# EAGLE design led-strip-main-connector (EAGLE 7.2.0)
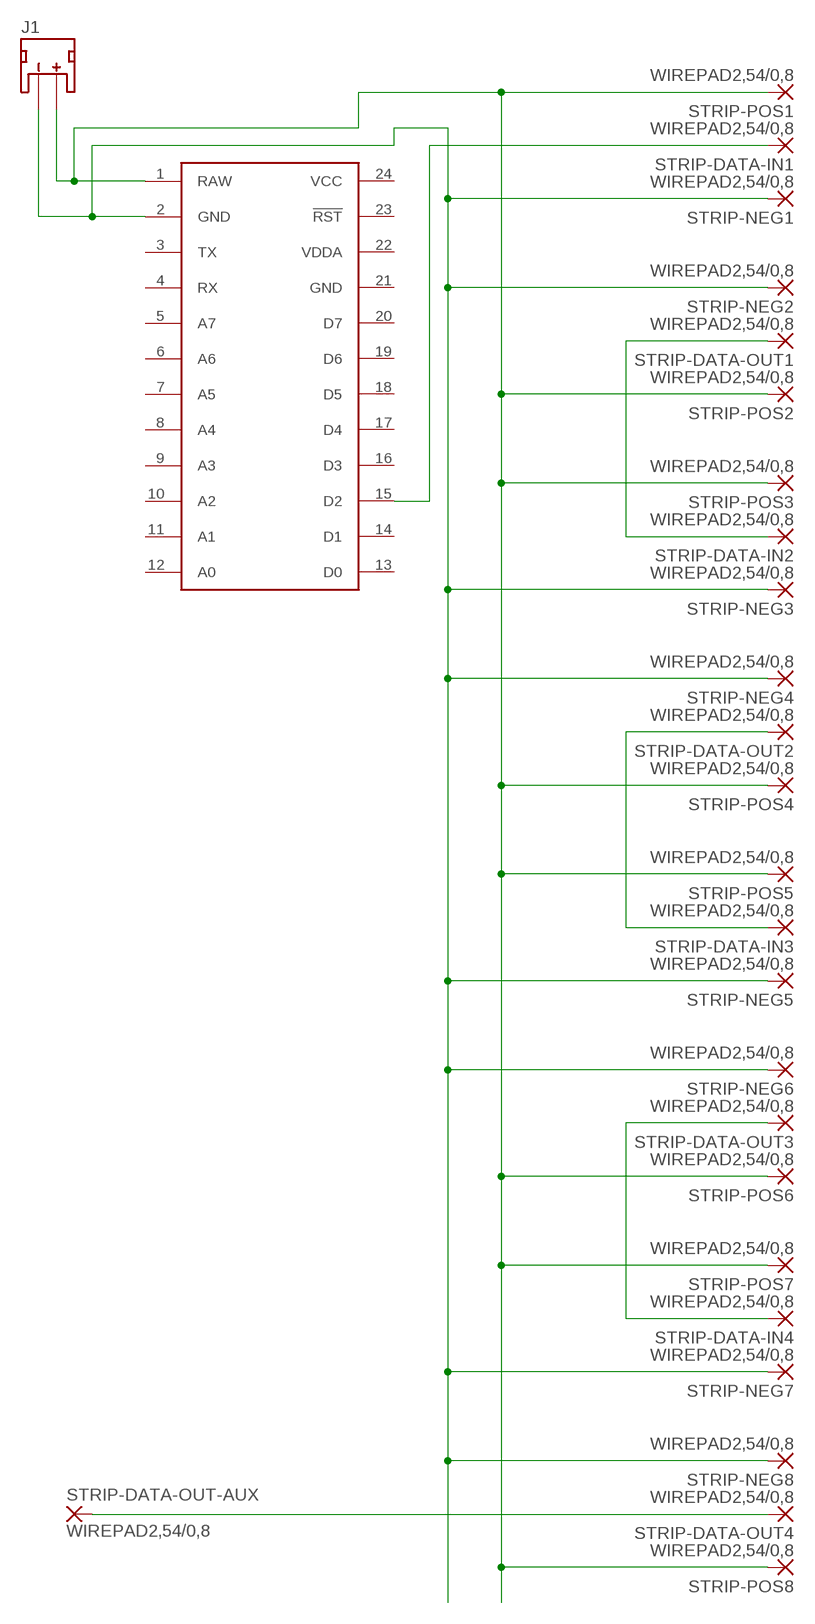
[diagram p0: schematic, sheet 1]

## Parts
J1  1  JST_2MM_MALE  [JST-2-SMD]
SPARK_CORE  SPARK_CORECORE  [SPARK_CORE]
STRIP-DATA-IN1  WIREPAD2,54/0,8  [2,54/0,8]
STRIP-DATA-IN2  WIREPAD2,54/0,8  [2,54/0,8]
STRIP-DATA-IN3  WIREPAD2,54/0,8  [2,54/0,8]
STRIP-DATA-IN4  WIREPAD2,54/0,8  [2,54/0,8]
STRIP-DATA-OUT1  WIREPAD2,54/0,8  [2,54/0,8]
STRIP-DATA-OUT2  WIREPAD2,54/0,8  [2,54/0,8]
STRIP-DATA-OUT3  WIREPAD2,54/0,8  [2,54/0,8]
STRIP-DATA-OUT4  WIREPAD2,54/0,8  [2,54/0,8]
STRIP-DATA-OUT-AUX  WIREPAD2,54/0,8  [2,54/0,8]
STRIP-NEG1  WIREPAD2,54/0,8  [2,54/0,8]
STRIP-NEG2  WIREPAD2,54/0,8  [2,54/0,8]
STRIP-NEG3  WIREPAD2,54/0,8  [2,54/0,8]
STRIP-NEG4  WIREPAD2,54/0,8  [2,54/0,8]
STRIP-NEG5  WIREPAD2,54/0,8  [2,54/0,8]
STRIP-NEG6  WIREPAD2,54/0,8  [2,54/0,8]
STRIP-NEG7  WIREPAD2,54/0,8  [2,54/0,8]
STRIP-NEG8  WIREPAD2,54/0,8  [2,54/0,8]
STRIP-POS1  WIREPAD2,54/0,8  [2,54/0,8]
STRIP-POS2  WIREPAD2,54/0,8  [2,54/0,8]
STRIP-POS3  WIREPAD2,54/0,8  [2,54/0,8]
STRIP-POS4  WIREPAD2,54/0,8  [2,54/0,8]
STRIP-POS5  WIREPAD2,54/0,8  [2,54/0,8]
STRIP-POS6  WIREPAD2,54/0,8  [2,54/0,8]
STRIP-POS7  WIREPAD2,54/0,8  [2,54/0,8]
STRIP-POS8  WIREPAD2,54/0,8  [2,54/0,8]

## Nets
N$1: SPARK_CORE.15(D2) STRIP-DATA-IN1.1(P)
N$3: STRIP-DATA-IN2.1(P) STRIP-DATA-OUT1.1(P)
N$5: J1.1(-) SPARK_CORE.2(GND) STRIP-NEG1.1(P) STRIP-NEG2.1(P) STRIP-NEG3.1(P) STRIP-NEG4.1(P) STRIP-NEG5.1(P) STRIP-NEG6.1(P) STRIP-NEG7.1(P) STRIP-NEG8.1(P)
N$6: J1.2(+) SPARK_CORE.1(RAW) STRIP-POS1.1(P) STRIP-POS2.1(P) STRIP-POS3.1(P) STRIP-POS4.1(P) STRIP-POS5.1(P) STRIP-POS6.1(P) STRIP-POS7.1(P) STRIP-POS8.1(P)
N$7: STRIP-DATA-IN3.1(P) STRIP-DATA-OUT2.1(P)
N$10: STRIP-DATA-IN4.1(P) STRIP-DATA-OUT3.1(P)
N$13: STRIP-DATA-OUT4.1(P) STRIP-DATA-OUT-AUX.1(P)
Unconnected: J1.NC1(PAD1) J1.NC2(PAD2) SPARK_CORE.3(TX) SPARK_CORE.4(RX) SPARK_CORE.5(A7) SPARK_CORE.6(A6) SPARK_CORE.7(A5) SPARK_CORE.8(A4) SPARK_CORE.9(A3) SPARK_CORE.10(A2) SPARK_CORE.11(A1) SPARK_CORE.12(A0) SPARK_CORE.13(D0) SPARK_CORE.14(D1) SPARK_CORE.16(D3) SPARK_CORE.17(D4) SPARK_CORE.18(D5) SPARK_CORE.19(D6) SPARK_CORE.20(D7) SPARK_CORE.23(!RST)

## Power pins joined to a net without a drawn wire
GND: SPARK_CORE.21(GND)
VCC: SPARK_CORE.24(VCC)
VDDA: SPARK_CORE.22(VDDA)

## Library data of the parts
J1 = SparkFun-Connectors:JST_2MM_MALE: Mates to single-cell LiPo batteries. CONN-08352; PROD_ID: CONN-08352
SPARK_CORE = Spark:SPARK_CORE
STRIP-DATA-IN1-STRIP-DATA-IN4 STRIP-DATA-OUT1-STRIP-DATA-OUT4 STRIP-DATA-OUT-AUX STRIP-NEG1-STRIP-NEG8 STRIP-POS1-STRIP-POS8 = wirepad:WIREPAD: Wire PAD connect wire on PCB

## Board
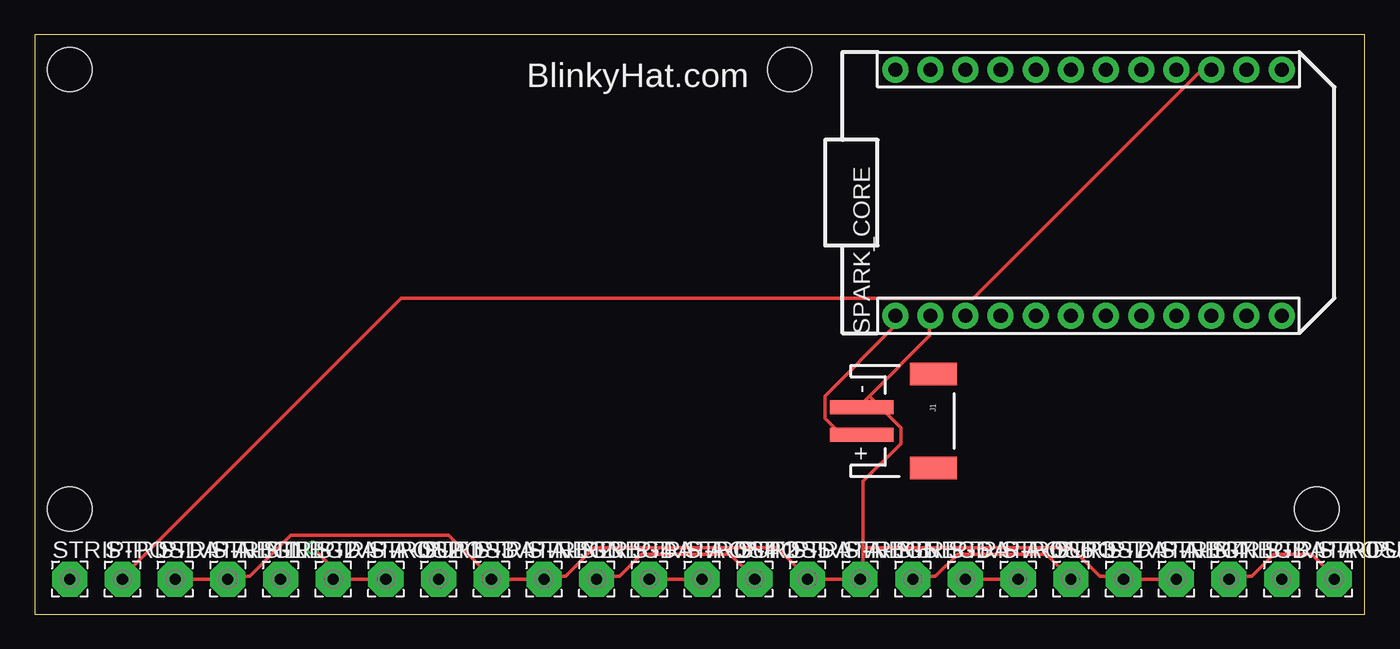
[diagram p1: board, top side]
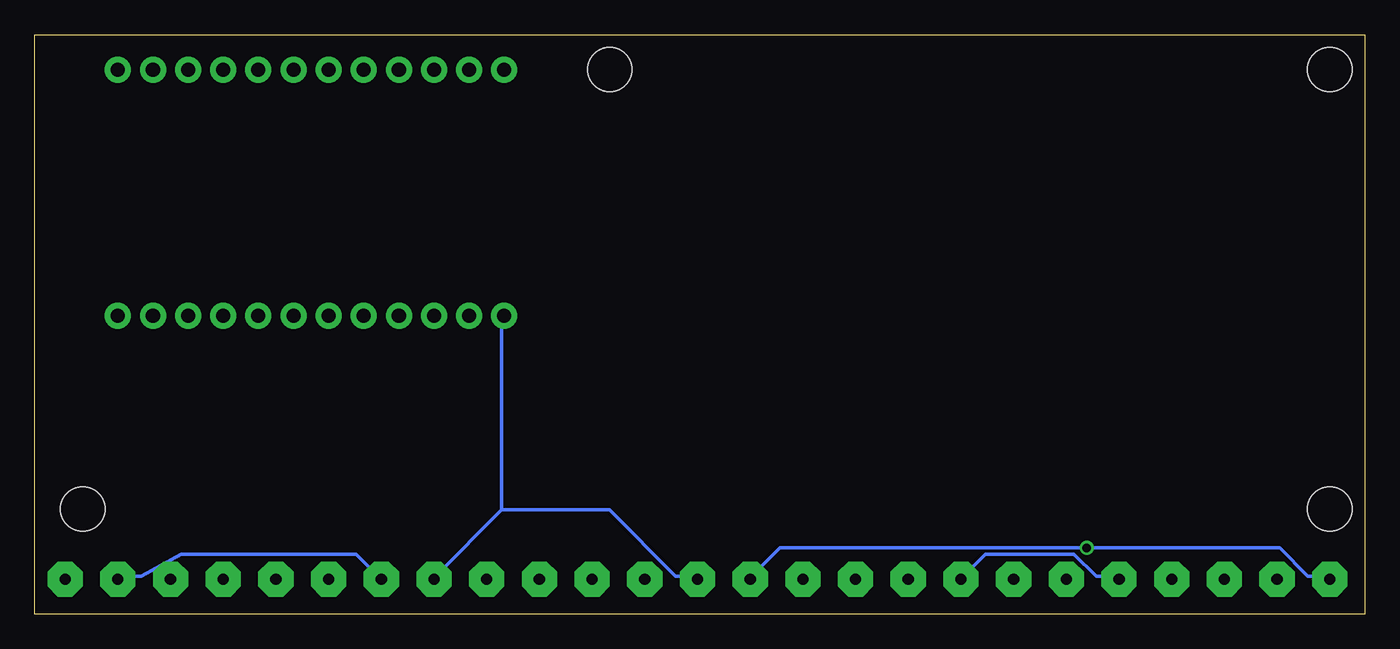
[diagram p2: board, bottom side, seen from below]

Size 96.19 x 41.9 mm. Coordinates in mm from the lower left corner, seen from the top.
Outline: 0,0 96.19,0 96.19,41.9 0,41.9 0,0
Copper layers (1*16): Top 0.035mm / dielectric 1.5mm / Bottom 0.035mm
Design rules "default": minimum track width 10mil, minimum drill 24mil, track to track 8mil, track to pad 8mil, pad to pad 8mil, via to via 8mil, smd to smd 8mil, copper to edge 40mil, drill to drill 8mil, minimum pad ring 10mil, minimum via ring 8mil, stop-mask expansion 4mil, vias tented up to drill 0mil, thermal gap 10mil
Holes 3.2 mm at 2.54,39.37 2.54,7.62 92.71,7.62 54.61,39.37

### Footprints (pad centres in the part's own frame; a part is rotated, then mirrored left to right if it is on the bottom)
JST-2-SMD = smd 1 x 4.6: 1 -1,-3.7; 2 1,-3.7 | smd 1.6 x 3.4: NC1 -3.4,1.5; NC2 3.4,1.5
SPARK_CORE = drill 1.016 pad 1.88: 1 -8.89,13.97; 2 -8.89,11.43; 3 -8.89,8.89; 4 -8.89,6.35; 5 -8.89,3.81; 6 -8.89,1.27; 7 -8.89,-1.27; 8 -8.89,-3.81; 9 -8.89,-6.35; 10 -8.89,-8.89; 11 -8.89,-11.43; 12 -8.89,-13.97; 13 8.89,-13.97; 14 8.89,-11.43; 15 8.89,-8.89; 16 8.89,-6.35; 17 8.89,-3.81; 18 8.89,-1.27; 19 8.89,1.27; 20 8.89,3.81; 21 8.89,6.35; 22 8.89,8.89; 23 8.89,11.43; 24 8.89,13.97
2,54/0,8 = drill 0.813 pad 2.54 octagon: 1 0,0

### Placement (x,y rotation side)
J1  63.5,13.97 270 top
SPARK_CORE  76.2,30.48 90 top
STRIP-DATA-IN1  6.35,2.54 0 top
STRIP-DATA-IN2  29.21,2.54 0 top
STRIP-DATA-IN3  52.07,2.54 0 top
STRIP-DATA-IN4  74.93,2.54 0 top
STRIP-DATA-OUT1  17.78,2.54 0 top
STRIP-DATA-OUT2  40.64,2.54 0 top
STRIP-DATA-OUT3  63.5,2.54 0 top
STRIP-DATA-OUT4  86.36,2.54 0 top
STRIP-DATA-OUT-AUX  93.98,2.54 0 top
STRIP-NEG1  10.16,2.54 0 top
STRIP-NEG2  13.97,2.54 0 top
STRIP-NEG3  33.02,2.54 0 top
STRIP-NEG4  36.83,2.54 0 top
STRIP-NEG5  55.88,2.54 0 top
STRIP-NEG6  59.69,2.54 0 top
STRIP-NEG7  78.74,2.54 0 top
STRIP-NEG8  82.55,2.54 0 top
STRIP-POS1  2.54,2.54 0 top
STRIP-POS2  21.59,2.54 0 top
STRIP-POS3  25.4,2.54 0 top
STRIP-POS4  44.45,2.54 0 top
STRIP-POS5  48.26,2.54 0 top
STRIP-POS6  67.31,2.54 0 top
STRIP-POS7  71.12,2.54 0 top
STRIP-POS8  90.17,2.54 0 top

### Tracks (layer width: path | path; a pad name or v marks a point on that pad's centre or on a via)
N$1
  Top 0.254: SPARK_CORE.15 85.04,39.32 84.35,39.32 67.89,22.86 26.52,22.86 6.4,2.74 STRIP-DATA-IN1.1
N$3
  Bottom 0.254: STRIP-DATA-OUT1.1 17.83,2.74 19.43,2.74 21.03,4.34 27.43,4.34 29.03,2.74 STRIP-DATA-IN2.1
N$5
  Top 0.254: STRIP-NEG1.1 10.29,2.52 13.95,2.52 STRIP-NEG2.1 14.17,2.74 15.54,2.74 18.52,5.71 29.95,5.71 32.92,2.74 STRIP-NEG3.1 33.15,2.52 36.8,2.52 STRIP-NEG4.1 37.03,2.74 38.41,2.74 40.46,4.8 53.72,4.8 55.78,2.74 STRIP-NEG5.1 56.01,2.52 59.66,2.52 STRIP-NEG6.1 59.89,2.74 59.89,4.8 | STRIP-NEG8.1 82.53,2.52 78.87,2.52 STRIP-NEG7.1 78.64,2.74 77.04,2.74 74.98,4.8 59.89,4.8 | 60.35,15.77 59.66,15.09 J1.1 | 60.35,15.77 64.69,20.12 64.69,21.49 SPARK_CORE.2 | 59.89,4.8 59.89,9.6 62.64,12.34 62.64,13.49 60.35,15.77
N$6  (via drill 0.61)
  Top 0.254: STRIP-POS3.1 25.38,2.52 21.72,2.52 STRIP-POS2.1 21.49,2.74 21.49,3.43 v20.12,4.8 | STRIP-POS5.1 48.23,2.52 44.58,2.52 STRIP-POS4.1 | SPARK_CORE.1 62.18,21.49 62.18,20.8 57.15,15.77 57.15,14.17 58.29,13.03 59.66,13.03 J1.2 | STRIP-POS6.1 67.44,2.52 71.09,2.52 STRIP-POS7.1
  Bottom 0.254: STRIP-POS1.1 2.74,2.74 4.12,2.74 6.17,4.8 v20.12,4.8 42.29,4.8 44.35,2.74 STRIP-POS4.1 | STRIP-POS7.1 72.92,4.34 85.6,4.34 88.47,2.74 90.07,2.74 STRIP-POS8.1 | 62.41,7.54 62.41,21.49 SPARK_CORE.1 | 62.41,7.54 67.21,2.74 STRIP-POS6.1 | 62.41,7.54 54.63,7.54 49.84,2.74 48.46,2.74 STRIP-POS5.1
N$7
  Top 0.254: STRIP-DATA-OUT2.1 40.69,2.74 42.29,2.74 43.89,4.34 50.29,4.34 51.89,2.74 STRIP-DATA-IN3.1
N$10
  Top 0.254: STRIP-DATA-OUT3.1 63.55,2.74 65.15,2.74 66.75,4.34 73.15,4.34 74.75,2.74 STRIP-DATA-IN4.1
N$13
  Top 0.254: STRIP-DATA-OUT4.1 86.41,2.74 88.01,2.74 89.61,4.34 92.35,4.34 93.95,2.74 STRIP-DATA-OUT-AUX.1

### Text on the board
tSilk: BlinkyHat.com